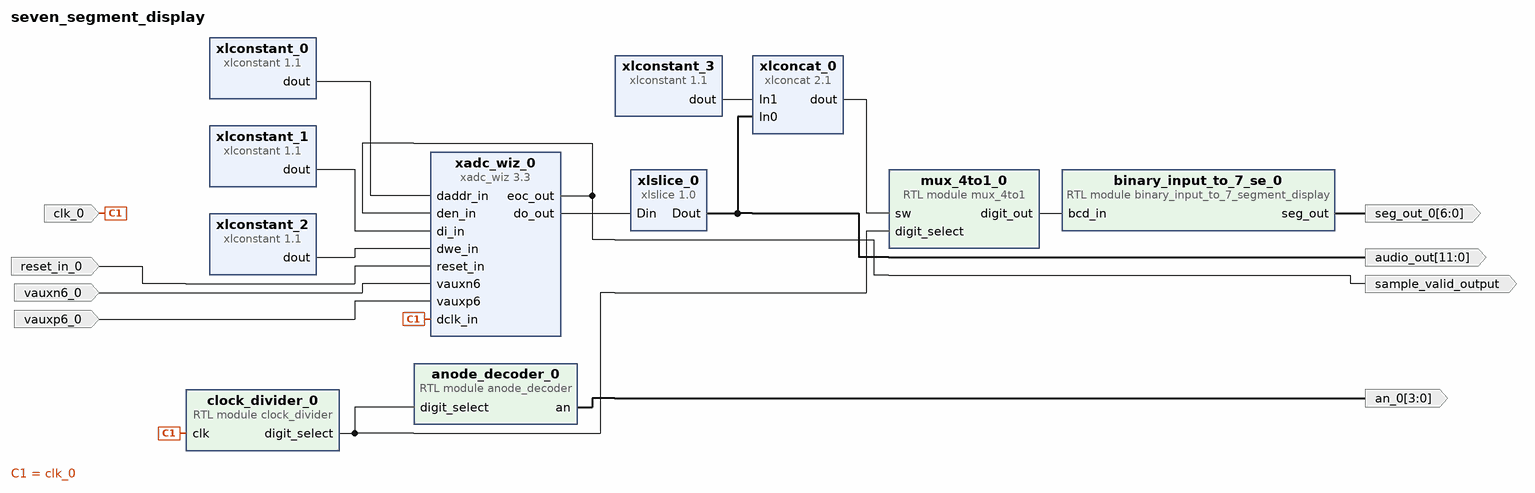
[diagram p0: block diagram of the top level]
# Vivado block design seven_segment_display, xc7a35tcpg236-1, Vivado 2025.2
create_bd_design seven_segment_display

create_bd_port -dir I -type clk clk_0
create_bd_port -dir O -from 3 -to 0 an_0
create_bd_port -dir O -from 6 -to 0 seg_out_0
create_bd_port -dir I -type rst reset_in_0
set_property -dict {CONFIG.POLARITY ACTIVE_HIGH} [get_bd_ports reset_in_0]
create_bd_port -dir I vauxn6_0
create_bd_port -dir I vauxp6_0
create_bd_port -dir O -from 11 -to 0 audio_out
create_bd_port -dir O sample_valid_output

create_bd_cell -type module -reference anode_decoder anode_decoder_0
create_bd_cell -type module -reference binary_input_to_7_segment_display binary_input_to_7_se_0
create_bd_cell -type module -reference clock_divider clock_divider_0
create_bd_cell -type module -reference mux_4to1 mux_4to1_0
create_bd_cell -type ip -vlnv xilinx.com:ip:xadc_wiz:3.3 xadc_wiz_0
set_property -dict [list \
  CONFIG.ENABLE_RESET true \
  CONFIG.INTERFACE_SELECTION ENABLE_DRP \
  CONFIG.OT_ALARM false \
  CONFIG.SINGLE_CHANNEL_SELECTION VAUXP6_VAUXN6 \
  CONFIG.USER_TEMP_ALARM false \
  CONFIG.VCCAUX_ALARM false \
  CONFIG.VCCINT_ALARM false \
] [get_bd_cells xadc_wiz_0]
create_bd_cell -type ip -vlnv xilinx.com:ip:xlconstant:1.1 xlconstant_0
set_property -dict {CONFIG.CONST_VAL 22 CONFIG.CONST_WIDTH 7} [get_bd_cells xlconstant_0]
create_bd_cell -type ip -vlnv xilinx.com:ip:xlconstant:1.1 xlconstant_1
set_property -dict {CONFIG.CONST_VAL 0 CONFIG.CONST_WIDTH 16} [get_bd_cells xlconstant_1]
create_bd_cell -type ip -vlnv xilinx.com:ip:xlconstant:1.1 xlconstant_2
set_property -dict {CONFIG.CONST_VAL 0} [get_bd_cells xlconstant_2]
create_bd_cell -type ip -vlnv xilinx.com:ip:xlslice:1.0 xlslice_0
set_property -dict {CONFIG.DIN_FROM 15 CONFIG.DIN_TO 4 CONFIG.DIN_WIDTH 16} [get_bd_cells xlslice_0]
create_bd_cell -type ip -vlnv xilinx.com:ip:xlconcat:2.1 xlconcat_0
set_property -dict {CONFIG.IN0_WIDTH 12 CONFIG.IN1_WIDTH 4} [get_bd_cells xlconcat_0]
create_bd_cell -type ip -vlnv xilinx.com:ip:xlconstant:1.1 xlconstant_3
set_property -dict {CONFIG.CONST_VAL 0 CONFIG.CONST_WIDTH 4} [get_bd_cells xlconstant_3]

# ---- connections ----

connect_bd_net [get_bd_pins anode_decoder_0/an] [get_bd_ports an_0]
connect_bd_net [get_bd_pins binary_input_to_7_se_0/seg_out] [get_bd_ports seg_out_0]
connect_bd_net -net clk_0_1 [get_bd_ports clk_0] [get_bd_pins clock_divider_0/clk] [get_bd_pins xadc_wiz_0/dclk_in]
connect_bd_net [get_bd_pins clock_divider_0/digit_select] [get_bd_pins anode_decoder_0/digit_select] [get_bd_pins mux_4to1_0/digit_select]
connect_bd_net [get_bd_pins mux_4to1_0/digit_out] [get_bd_pins binary_input_to_7_se_0/bcd_in]
connect_bd_net -net reset_in_0_1 [get_bd_ports reset_in_0] [get_bd_pins xadc_wiz_0/reset_in]
connect_bd_net -net vauxn6_0_1 [get_bd_ports vauxn6_0] [get_bd_pins xadc_wiz_0/vauxn6]
connect_bd_net -net vauxp6_0_1 [get_bd_ports vauxp6_0] [get_bd_pins xadc_wiz_0/vauxp6]
connect_bd_net [get_bd_pins xadc_wiz_0/do_out] [get_bd_pins xlslice_0/Din]
connect_bd_net [get_bd_pins xadc_wiz_0/eoc_out] [get_bd_pins xadc_wiz_0/den_in] [get_bd_ports sample_valid_output]
connect_bd_net [get_bd_pins xlconcat_0/dout] [get_bd_pins mux_4to1_0/sw]
connect_bd_net [get_bd_pins xlconstant_0/dout] [get_bd_pins xadc_wiz_0/daddr_in]
connect_bd_net [get_bd_pins xlconstant_1/dout] [get_bd_pins xadc_wiz_0/di_in]
connect_bd_net [get_bd_pins xlconstant_2/dout] [get_bd_pins xadc_wiz_0/dwe_in]
connect_bd_net [get_bd_pins xlconstant_3/dout] [get_bd_pins xlconcat_0/In1]
connect_bd_net [get_bd_pins xlslice_0/Dout] [get_bd_pins xlconcat_0/In0] [get_bd_ports audio_out]

validate_bd_design
save_bd_design
